# Altium schematic sheet RS485.SchDoc
size 420 x 297 mm; SheetNumber: 22; SheetTotal: 34
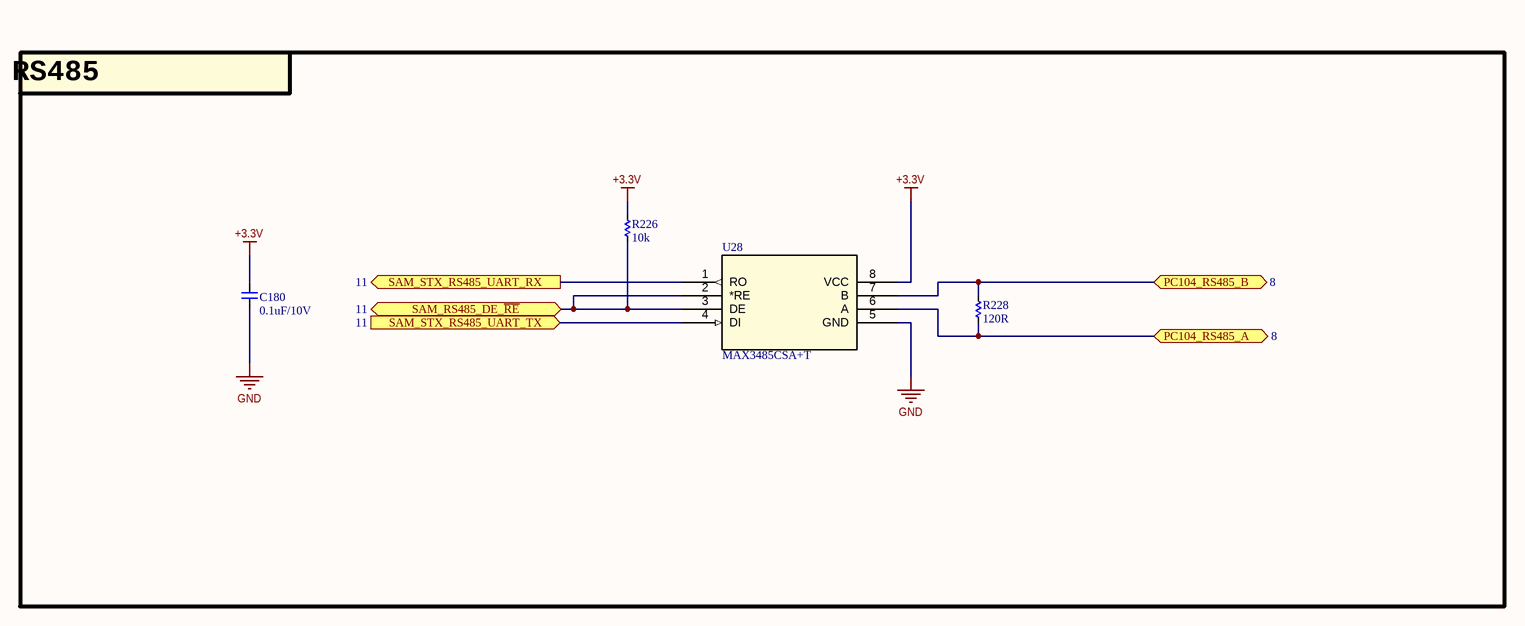
[diagram p0: RS485.SchDoc]

## Parts
C180  0.1uF/10V  [CAP_C_1005X50_L]
R226  10k  [RES_C_1005x30_L]
R228  120R  [RES_C_1005x30_L]
U28  MAX3485CSA+T  [21-0041-3-M_90-0096-8L_MXM]

## Blocks framed on the sheet
RS485: C180 R226 R228 U28

## Ports
PC104_RS485_A (bidir, see 8), PC104_RS485_B (bidir, see 8), SAM_RS485_DE_~{RE} (bidir, see 11), SAM_STX_RS485_UART_RX (out, see 11), SAM_STX_RS485_UART_TX (in, see 11)

## Nets
+3.3V: C180.2 R226.1 U28.8(VCC)
GND: C180.1 U28.5(GND)
PC104_RS485_A: R228.2 U28.6(A) ; port PC104_RS485_A
PC104_RS485_B: R228.1 U28.7(B) ; port PC104_RS485_B
SAM_RS485_DE_~{RE}: R226.2 U28.2(*RE) U28.3(DE) ; port SAM_RS485_DE_~{RE}
SAM_STX_RS485_UART_RX: U28.1(RO) ; port SAM_STX_RS485_UART_RX
SAM_STX_RS485_UART_TX: U28.4(DI) ; port SAM_STX_RS485_UART_TX

## Notes on the sheet
- Project:
- Sub-system:
- Design by:
- Sheet title:
- Sheet
- of
- Checked by:
- Approved by:
- Revision:
- Document No:
- Size:
- Date:
- A3

## Library data of the parts
C180 = _CAP_C_2: CAP
R226 R228 = _RES_B_2: RES
U28 = MAX3485CSA+T: Low-Power, Slew-Rate-Limited RS-485/RS-422 Transceivers, IC TRANSCEIVER HALF 1/1 8SOIC; Manufacturer_Name: Analog Devices Inc; Manufacturer_Part_Number: MAX485CSA+T; Copyright: Copyright (C) 2025 Ultra Librarian. All rights reserved.; RefDes: RefDes; Type: Type